# Altium schematic sheet Copy of BQ76952_monitor.SchDoc
size A4; SheetNumber: 1; SheetTotal: 2
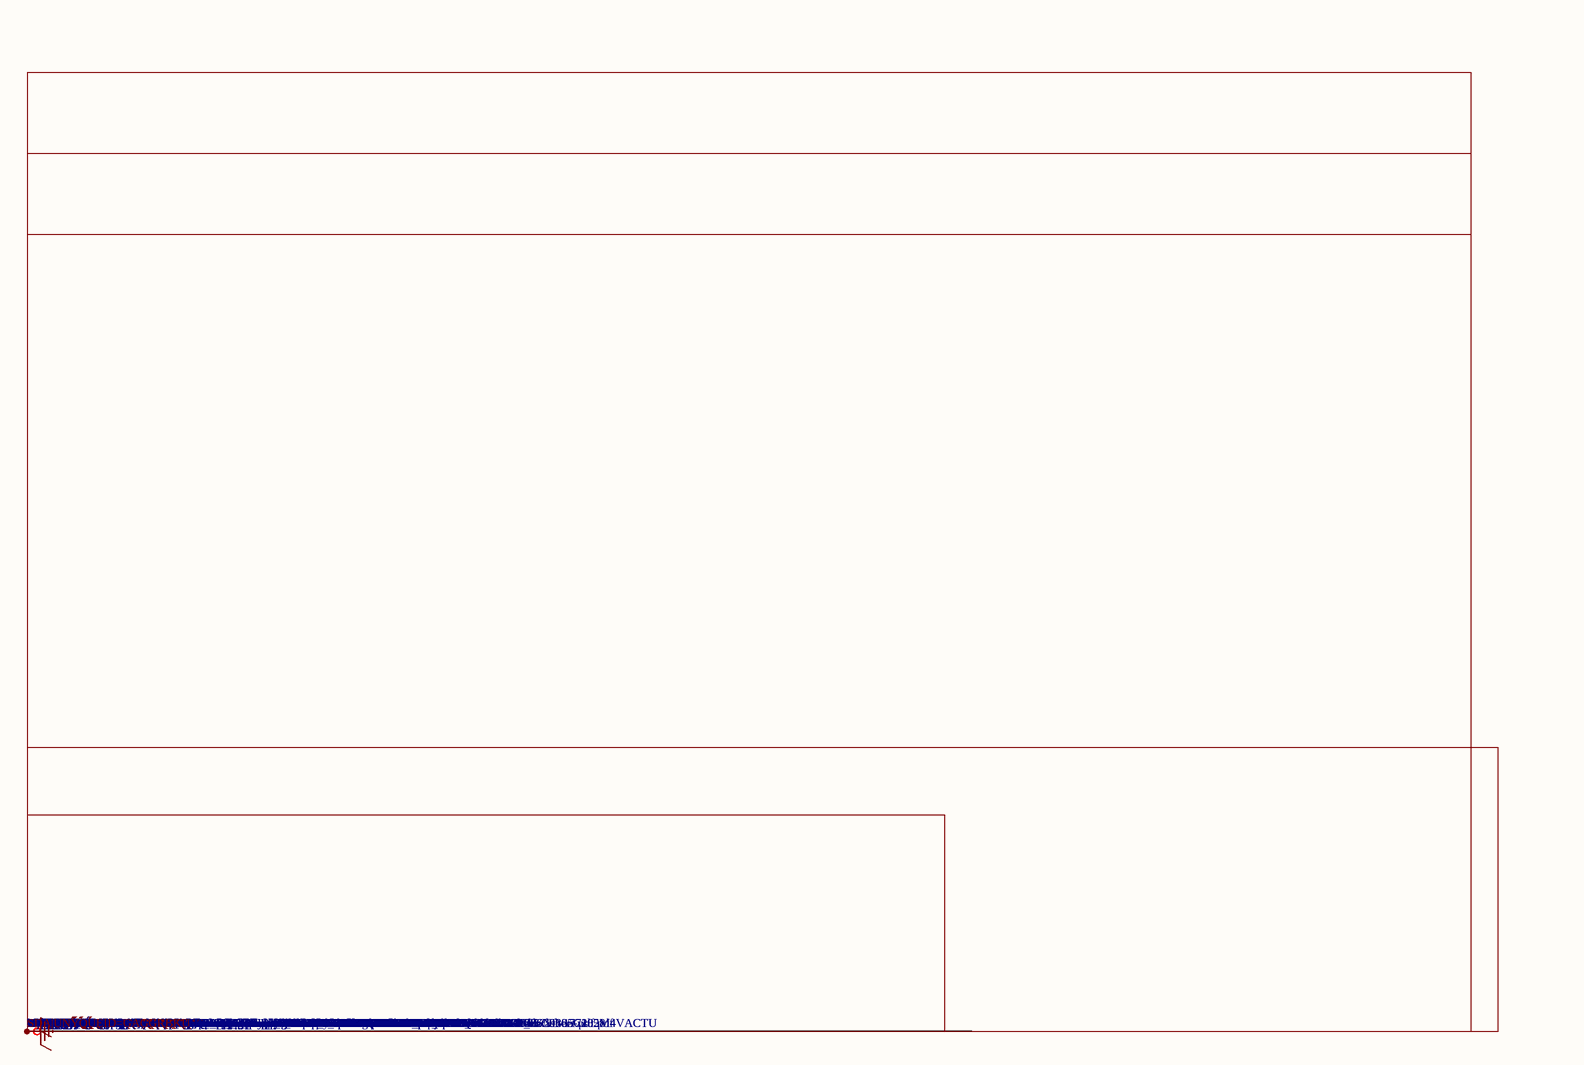
[diagram p0: Copy of BQ76952_monitor.SchDoc]

## Notes on the sheet
- unutma|UNÝQUEID=GCXIWKGR